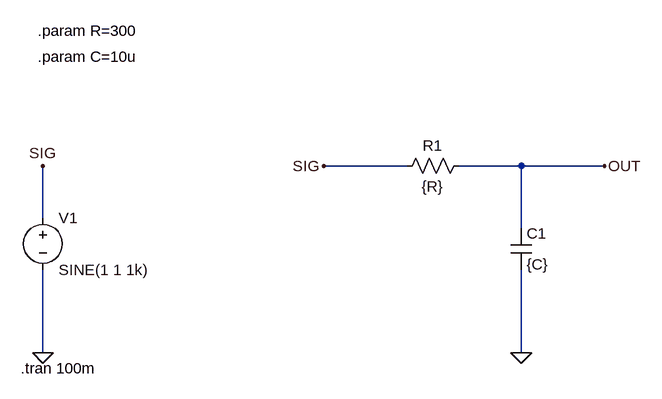
[diagram p0: schematic LPF_RC.asc]
LPF_RC.asc, the LTspice schematic file:
Version 4
SHEET 1 880 680
WIRE -160 -128 -288 -128
WIRE 16 -128 -80 -128
WIRE 144 -128 16 -128
WIRE -720 -48 -720 -128
WIRE 16 -32 16 -128
WIRE -720 160 -720 32
WIRE 16 160 16 32
FLAG -288 -128 SIG
FLAG 16 160 0
FLAG -720 -128 SIG
FLAG -720 160 0
FLAG 144 -128 OUT
SYMBOL res -176 -112 R270
WINDOW 0 32 56 VTop 2
WINDOW 3 0 56 VBottom 2
SYMATTR InstName R1
SYMATTR Value {R}
SYMBOL cap 0 -32 R0
SYMATTR InstName C1
SYMATTR Value {C}
SYMBOL voltage -720 -64 R0
WINDOW 123 0 0 Left 2
WINDOW 39 0 0 Left 2
SYMATTR InstName V1
SYMATTR Value SINE(1 1 1k)
TEXT -728 -336 Left 2 !.param R=300
TEXT -728 -296 Left 2 !.param C=10u
TEXT -754 184 Left 2 !.tran 100m

The netlist it stands for:
* LPF_RC.asc
R1 SIG OUT {R}
C1 OUT 0 {C}
V1 SIG 0 SINE(1 1 1k)
.param R=300
.param C=10u
.tran 100m
.backanno
.end

* Results of the author's LTspice run, read from the files saved beside the schematic
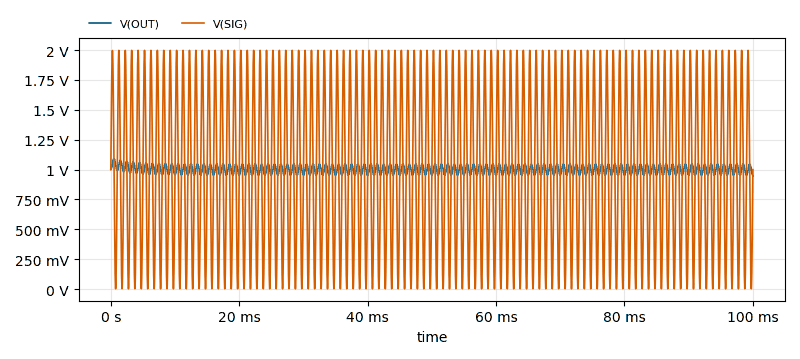
[diagram p1: Transient Analysis of LPF_RC.asc, plotted from the saved traces]
* Transient Analysis, 1 run:
*   V(OUT): min 947.6 mV, max 1.093 V, average 1.002 V, rms 1.002 V, last 947.6 mV
*   V(SIG): min 2.51 mV, max 1.997 V, average 1 V, rms 1.224 V, last 1 V